# Altium schematic sheet 05-TCXO_Crystal.SchDoc
size B; SheetNumber: 4; SheetTotal: 7
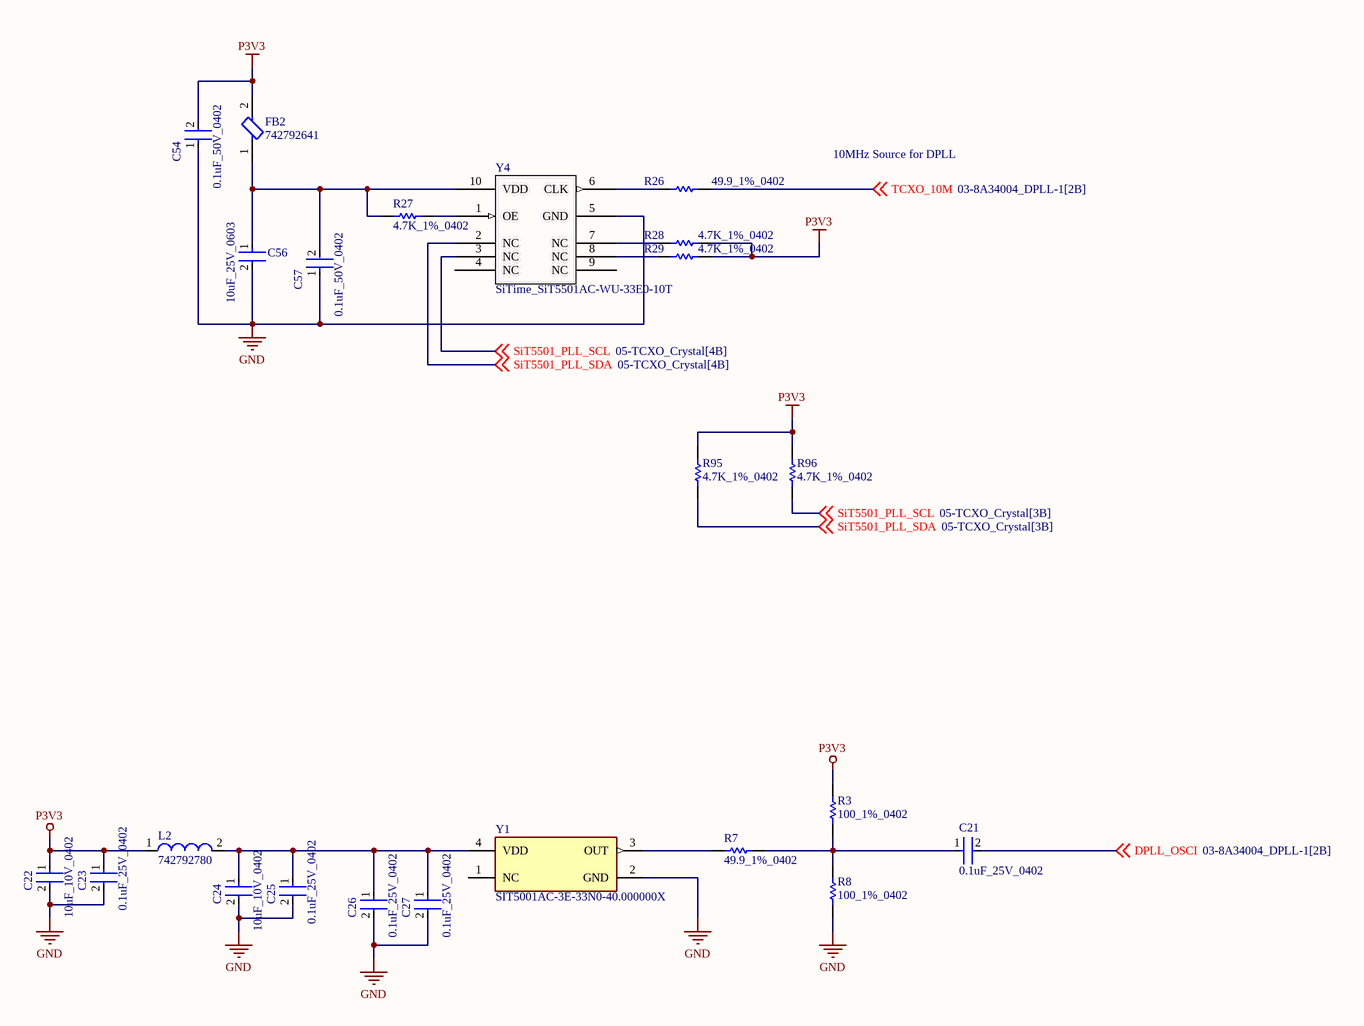
[diagram p0: 05-TCXO_Crystal.SchDoc]

## Parts
C21  0.1uF_25V_0402  [FP-0402-L_1_0_1-W_0_5_0_1-IPC_C]
C22  10uF_10V_0402  [FP-CL05A106MP5NUNC-MFG]
C23  0.1uF_25V_0402  [FP-0402-L_1_0_1-W_0_5_0_1-IPC_C]
C24  10uF_10V_0402  [FP-CL05A106MP5NUNC-MFG]
C25  0.1uF_25V_0402  [FP-0402-L_1_0_1-W_0_5_0_1-IPC_C]
C26  0.1uF_25V_0402  [FP-0402-L_1_0_1-W_0_5_0_1-IPC_C]
C27  0.1uF_25V_0402  [FP-0402-L_1_0_1-W_0_5_0_1-IPC_C]
C54  0.1uF_50V_0402  [FP-C1005-050-0_05-IPC_C]
C56  10uF_25V_0603  [FP-CL10-IPC_C]
C57  0.1uF_50V_0402  [FP-C1005-050-0_05-IPC_C]
FB2  742792641  [FP-742792641-MFG]
L2  742792780  [SMD-0402]
R3  100_1%_0402  [RESC1005X40X25ML05T10]
R7  49.9_1%_0402  [RESC1005X40X25NL10T10]
R8  100_1%_0402  [RESC1005X40X25ML05T10]
R26  49.9_1%_0402  [RESC1005X40X25NL10T10]
R27  4.7K_1%_0402  [RESC1005X40X25NL10T10]
R28  4.7K_1%_0402  [RESC1005X40X25NL10T10]
R29  4.7K_1%_0402  [RESC1005X40X25NL10T10]
R95  4.7K_1%_0402  [RESC1005X40X25NL10T10]
R96  4.7K_1%_0402  [RESC1005X40X25NL10T10]
Y1  SIT5001AC-3E-33N0-40.000000X  [FP-SiT5001-3-MFG]
Y4  SiTime_SiT5501AC-WU-33E0-10T  [SITIME_SPL-086-CQFN-010-C07050_REV_DRAFT]

## Nets
GND: C22.2 C23.2 C24.2 C25.2 C26.2 C27.2 C54.1 C56.2 C57.1 R8.1 Y1.2(GND) Y4.5(GND)
P3V3: C22.1 C23.1 C54.2 FB2.2 L2.1 R3.2 R28.2 R29.2 R95.2 R96.2
DPLL_OSCI: C21.2 ; off-sheet DPLL_OSCI
SiT5501_PLL_SCL: R96.1 Y4.3(NC) ; off-sheet SiT5501_PLL_SCL
SiT5501_PLL_SDA: R95.1 Y4.2(NC) ; off-sheet SiT5501_PLL_SDA
TCXO_10M: R26.1 ; off-sheet TCXO_10M
NetC21_1: C21.1 R3.1 R7.2 R8.2
NetC24_1: C24.1 C25.1 C26.1 C27.1 L2.2 Y1.4(VDD)
NetC56_1: C56.1 C57.2 FB2.1 R27.1 Y4.10(VDD)
NetR7_1: R7.1 Y1.3(OUT)
NetR26_2: R26.2 Y4.6(CLK)
NetR27_2: R27.2 Y4.1(OE)
NetR28_1: R28.1 Y4.7(NC)
NetR29_1: R29.1 Y4.8(NC)

Not connected (* = marked no-connect by the designer): Y1 1(NC); Y4 4(NC) 9(NC)

## Notes on the sheet
- 10MHz Source for DPLL

## Library data of the parts
C21 C23 C25-C27 = CMP-2008-02519-2: General Purpose Ceramic Capacitor, 0402, 100nF, 10%, X7R, 15%, 25V; Package Quantity: 1; Capacitance: 100nF; Min Operating Temperature: -55°C; Voltage: 25V; Voltage Rating: 25V; Construction: Flat; Max Operating Temperature: 125°C; Radiation Hardening: No; Depth: 0.5mm; Thickness: 0.022inch; Voltage Rating (DC): 25V; Number of Pins: 2; Lead Free: Lead Free; Series: -; REACH SVHC: No SVHC; Length: 1mm; Dielectric: X7R; RoHS Compliant: Yes; Mount: Surface Mount; Packaging: Tape and Reel; Case/Package: 0402; Case Code (Imperial): 0402; Termination: SMD/SMT; Width: 0.02inch; Case Code (Metric): 1005; Tolerance: 10%
C22 C24 = CMP-13271-000002-1: CAP CER 10UF 10V X5R 0402; Manufacturer Part Number: CL05A106MP5NUNC; Manufacturer: Samsung; Temperature Coefficient: 15%; Tolerance: 20%; Material: Ceramic; Octopart: https://octopart.com/cl05a106mp5nunc-samsung-22457395; Voltage Rating: 10V; RoHS: TRUE; Value: 10uF; Height: 0.7mm; Digikey Description: CAP CER 10UF 10V X5R 0402; Automotive: No; Package: CL05A106MP5NUNC; Device Class L1: Passive Components; Capacitance: 10uF; Temperature Range High: +85°C; ComponentLink2Description: Datasheet; Device Class L2: Capacitors; Temperature Characteristic: X5R; Temperature: -55°C to +85°C; ComponentLink2URL: http://www.samsungsem.com/kr/support/product-search/mlcc/__icsFiles/afieldfile/2019/05/10/19-CL05A106MP5NUNC.pdf; Device Class L3: Ceramic Capacitors; Category: Cap; Temperature Range Low: -55°C; Ipc Land Pattern Name: CAPC10050X50; Lead Free: Yes
C54 C57 = CMP-2000-05393-2: Multilayer Ceramic Capacitors 100nF ±10% 50V X7R SMD 0402; Voltage: 50V; Dielectric Material: Ceramic; Min Operating Temperature: -55°C; Depth: 0.5mm; Radiation Hardening: No; RoHS Compliant: Yes; Voltage Rating (DC): 50V; Lead Free: Lead Free; Resistor Type: Ceramic; Height: 0.5mm; Dielectric: X7R; Thickness: 0.022inch; Case/Package: 0402; Case Code (Metric): 1005; Termination: SMD/SMT; Capacitance: 100nF; Packaging: Tape and Reel; Max Operating Temperature: 125°C; Mount: Surface Mount; Package Quantity: 1; Width: 0.02inch; Weight: 2.3E-05oz; Voltage Rating: 50V; Tolerance: 10%; Construction: Flat; Case Code (Imperial): 0402; Length: 1mm; REACH SVHC: No SVHC; Series: C
C56 = CMP-13271-004224-1: Cap Ceramic 10uF 25V X5R ±20% Pad SMD 0603 +85°C T/R; Width: 0.031inch; Voltage Rating: 25V; Length: 0.063inch; Case Code (Metric): 1608; Dielectric: X5R; Termination: Wraparound; Capacitance: 10uF; Lead Free: Lead Free; Mount: Surface Mount; Package Quantity: 1; Case Code (Imperial): 0603; Thickness: 0.035inch; Packaging: Tape and Reel; Contact Plating: Tin; Min Operating Temperature: -55°C; Tolerance: 20%; Max Operating Temperature: 85°C; Case/Package: 0603
FB2 = CMP-0220-00171-2: FERRITE BEAD 300 OHM 0603 1LN; Inductance: 18nH; Max DC Current: 2A; Number of Lines: 1; Test Frequency: 100MHz; Impedance: 300R; DC Resistance (DCR): 150mR; Tolerance: 25%; Case Code (Metric): 1608; Core Material: Ferrite; Length: 1.6mm; Lead Free: Lead Free; Series: WE-CBF; Min Operating Temperature: -55°C; RoHS Compliant: Yes; Case/Package: SMD/SMT; Material: Ferrite; Max Operating Temperature: 125°C; Termination: SMD/SMT; Packaging: Tape and Reel; Weight: 0.000141oz; Case Code (Imperial): 0603; Width: 0.8mm; Mount: Surface Mount; Max Current Rating: 2A; Package Quantity: 1; Depth: 0.8mm; Current Rating: 2A; Height: 0.8mm
L2 = CMP-0220-00137-1: SMD EMI Suppression Ferrite Bead WE-CBF, Z = 220 Ohm; Impedance: 220 Ohm; PackageVersion: 2009; DatasheetVersion: ver 4, Jul-2009; PackageDescription: Chip Inductor, 2-Leads, Body 1.0 x 0.5 mm; ComponentLink1URL: http://www.we-online.com; ComponentLink1Description: Manufacturer Link; ComponentLink2URL: http://www.we-online.de/katalog/media/pdf/742792780.pdf; PackageReference: SMD-0402; ComponentLink2Description: Datasheet
R3 R8 = CMP-2002-06458-1: Part Number: ERJ-U02F1000X; Manufacturer: Panasonic
R7 R26 = CMP-2002-04448-1: Part Number: RK73H1ETTP49R9F; Manufacturer: KOA Speer
R27-R29 R95 R96 = CMP-2002-05217-1: Manufacturer: Bourns; Part Number: CR0402-FX-4701GLF
Y1 = CMP-25159-259584-1: MEMS OSC TCXO 40.0000MHZ LVCMOS; Frequency Stability: 5ppm; Max Supply Current: 33mA; Frequency: 40MHz; Case/Package: SMD/SMT; Packaging: Cut Tape; Min Operating Temperature: -20°C; Mount: Surface Mount; Length: 0.197inch; Series: SiT5001; Max Operating Temperature: 70°C; Height: 0.031inch; Width: 0.126inch
Y4 = CMP-OSC-00029-2: OSC, MEMS, STRATUM 3E, 10.000MHZ, 10PPB STAB, LVCMOS, 3.3V, O/P EN, 7.0X5.0X2.2MM, CQFN-10; Manufacturer Part Number: SiT5501AI-WU033JH-10.000000; Manufacturer: SiTime; Frequency: 10 MHz; Voltage - Supply: 3.3 V; Type: OCXO; Category: Oscillators; Max Operating Temperature: 70°C; Min Operating Temperature: -20°C; Height: 2.20mm (max); Case/Package: 10 Lead QFN; Output: LVCMOS; Mounting Type: Surface Mount; Frequency Stability: ±10 ppb; RoHS: Yes